# EAGLE design LPS33HW_breakout (EAGLE 8.2.2)
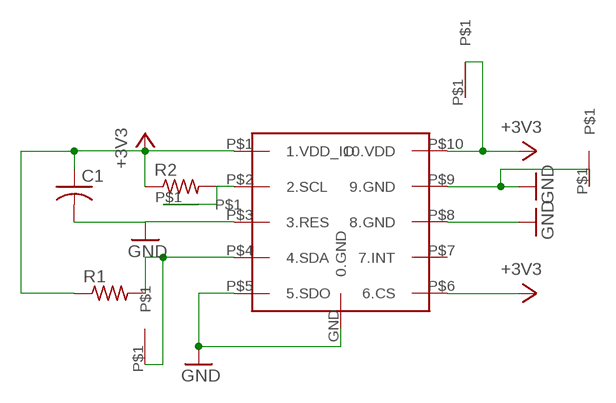
[diagram p0: schematic, sheet 1]

## Parts
C1  C-USC0402  [C0402]
R1  R-US_R0402  [R0402]
R2  R-US_R0402  [R0402]
U$1  LPS33HW  [LPS33HW]
U$2  VIA  [VIA]
U$3  VIA  [VIA]
U$4  VIA  [VIA]
U$5  VIA  [VIA]

## Nets
+3V3: C1.1 R1.1 R2.1 U$1.P$1(1.VDD_IO) U$1.P$6(6.CS) U$1.P$10(10.VDD) U$2.P$1
GND: C1.2 U$1.GND(0.GND) U$1.P$3(3.RES) U$1.P$5(5.SDO) U$1.P$8(8.GND) U$1.P$9(9.GND) U$3.P$1
N$1: R2.2 U$1.P$2(2.SCL) U$5.P$1
N$2: R1.2 U$1.P$4(4.SDA) U$4.P$1
Unconnected: U$1.P$7(7.INT)

## Library data of the parts
C1 = resistor:C-US: CAPACITOR, American symbol
R1 R2 = resistor:R-US_: RESISTOR, American symbol
U$1 = Sombeck_lib:LPS33HW
U$2-U$5 = Sombeck_lib:VIA

## Board
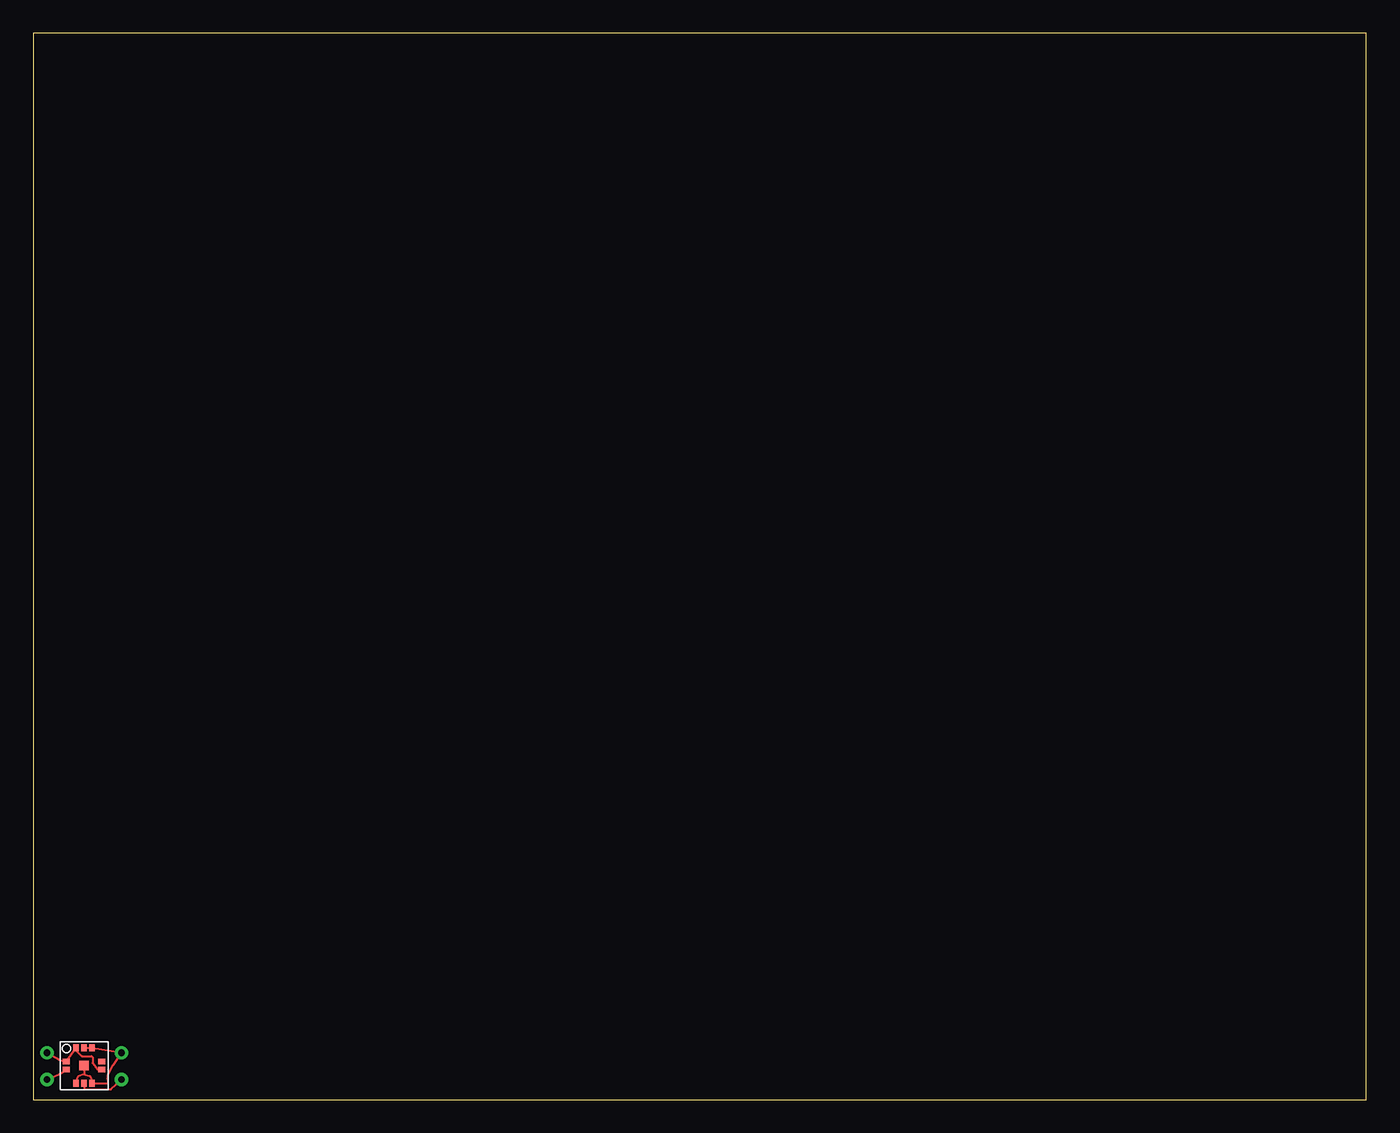
[diagram p1: board, top side]
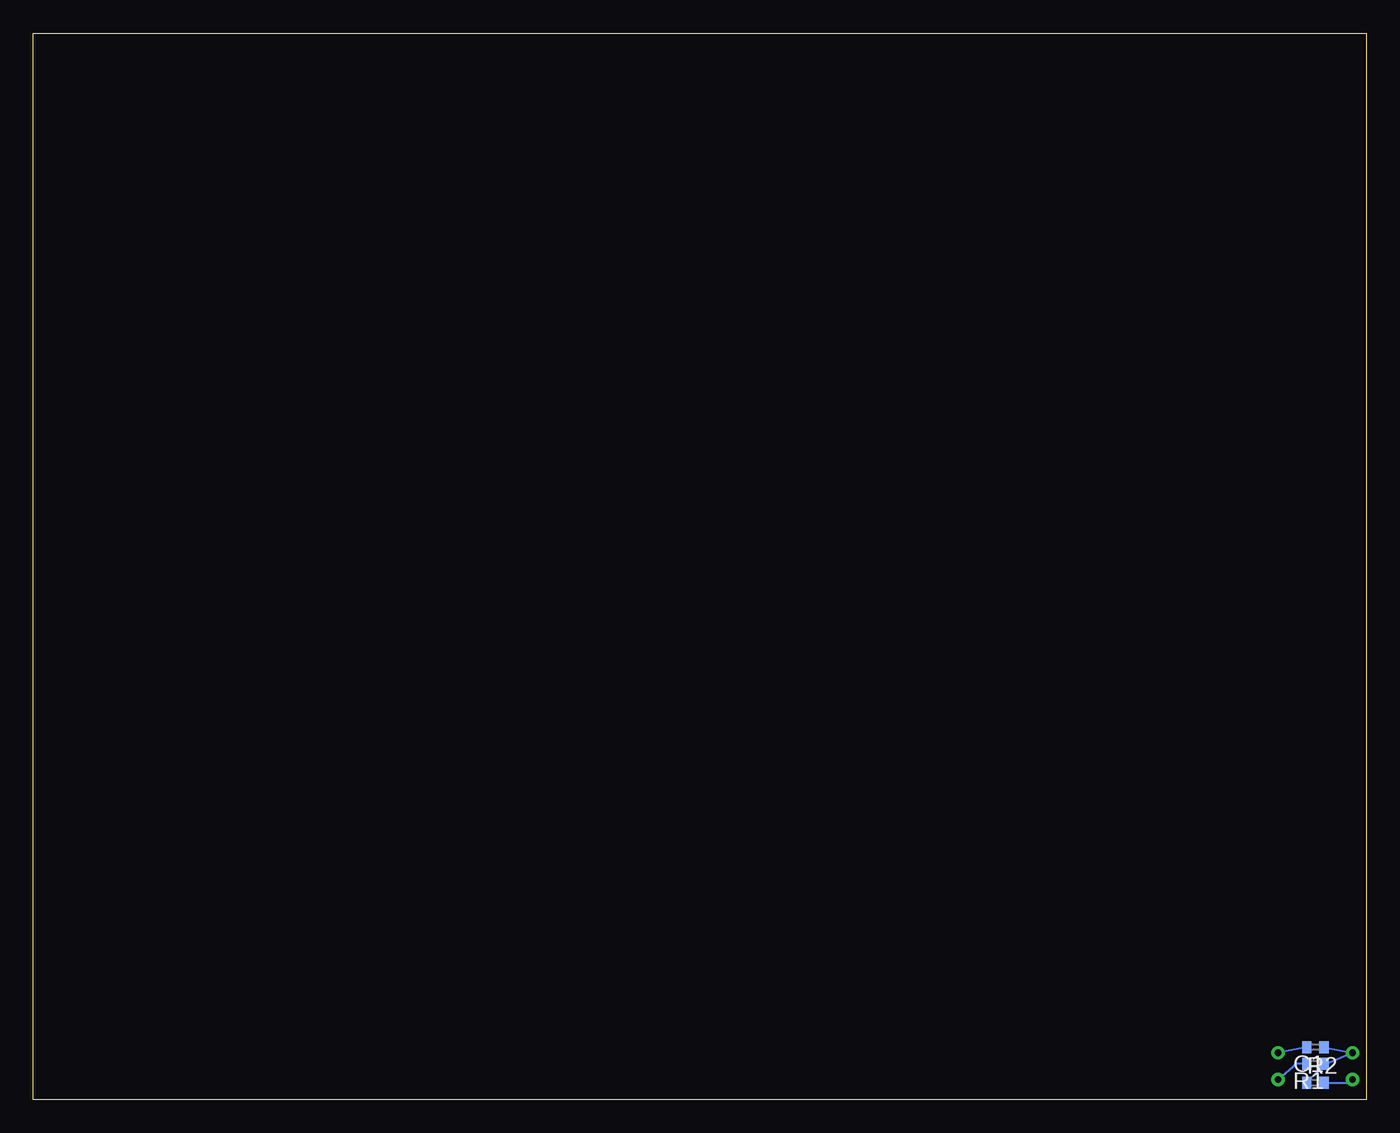
[diagram p2: board, bottom side, seen from below]

Size 100 x 80 mm. Coordinates in mm from the lower left corner, seen from the top.
Outline: 0,0 100,0 100,80 0,80 0,0
Copper layers (1*16): Top 0.035mm / dielectric 1.5mm / Bottom 0.035mm
Design rules "default": minimum track width 6mil, minimum drill 0.35mm, track to track 6mil, track to pad 6mil, pad to pad 6mil, via to via 6mil, smd to smd 6mil, copper to edge 40mil, drill to drill 6mil, minimum pad ring 10mil, minimum via ring 8mil, stop-mask expansion 4mil, vias tented up to drill 0mil, thermal gap 10mil

### Footprints (pad centres in the part's own frame; a part is rotated, then mirrored left to right if it is on the bottom)
C0402 = smd 0.7 x 0.9: 1 -0.65,0; 2 0.65,0
R0402 = smd 0.7 x 0.9: 1 -0.65,0; 2 0.65,0
LPS33HW = smd 0.7 x 0.7: GND 0,0 | smd 0.525 x 0.425: P$1 -1.325,0.3; P$2 -1.325,-0.3; P$6 1.325,-0.3; P$7 1.325,0.3 | smd 0.425 x 0.525: P$3 -0.6,-1.325; P$4 0,-1.325; P$5 0.6,-1.325; P$8 0.6,1.325; P$9 0,1.325; P$10 -0.6,1.325
VIA = drill 0.5 pad 0.813: P$1 0,0

### Placement (x,y rotation side)
C1  3.81,3.94 180 bottom
R1  3.81,2.67 180 bottom
R2  3.81,1.27 0 bottom
U$1  3.81,2.54 0 top
U$2  1.02,3.51 0 top
U$3  6.6,3.51 0 top
U$4  6.6,1.5 0 top
U$5  1.02,1.5 0 top

### Tracks (layer width: path | path; a pad name or v marks a point on that pad's centre or on a via)
+3V3
  Top 0.152: U$1.P$6 4.98,2.27 4.78,2.27 4.45,2.73 4.45,3.17 4.37,3.25 3.64,3.25 3.23,3.65 U$1.P$10 U$1.P$1 1.91,2.99 U$2.P$1
  Bottom 0.152: R2.1 4.46,1.24 3.23,2.59 | 3.23,2.59 R1.1 | C1.1 U$2.P$1 3.23,2.59
GND
  Top 0.152: U$1.P$3 3.17,1.25 3.38,1.75 3.8,1.91 | U$1.P$9 U$1.P$8 6.55,3.56 U$3.P$1 6.01,2.6 5.6,1.91 5.59,1.8 5.6,1.22 U$1.P$5 4.45,1.25 4.27,1.75 3.8,1.91 | U$1.GND 3.81,1.92 3.8,1.91
  Bottom 0.152: C1.2 5.64,3.71 U$3.P$1
N$1
  Top 0.152: U$5.P$1 1.95,1.91 U$1.P$2
  Bottom 0.152: R2.2 1.4,1.27 U$5.P$1
N$2
  Top 0.152: 3.81,1.09 U$1.P$4 3.81,0.76 5.82,0.76 U$4.P$1
  Bottom 0.152: R1.2 5.21,2.67 U$4.P$1